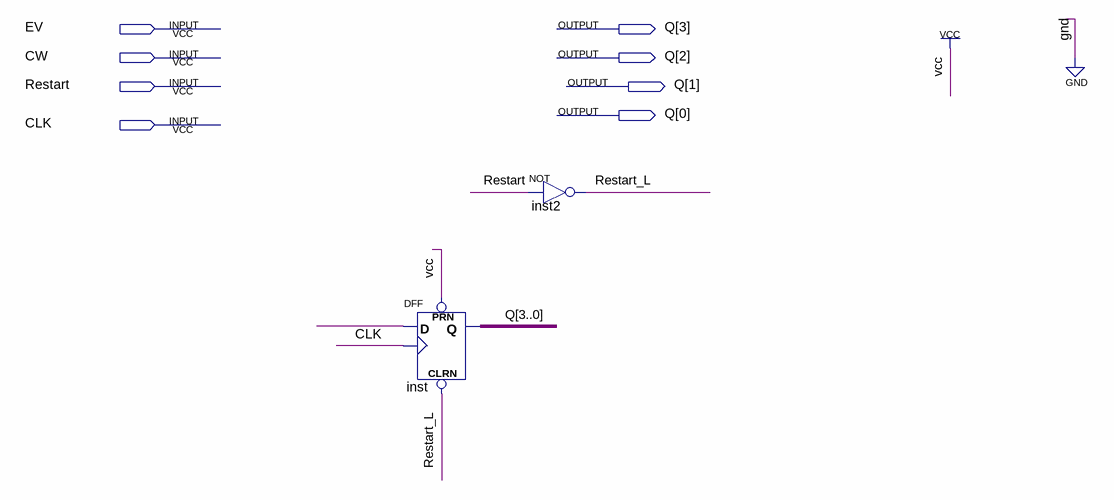
[diagram p0: schematic sheet]
// Quartus schematic Lab5_DFF_Traf_Cont.bdf as structural Verilog: 2 symbols, 8 pins
module Lab5_DFF_Traf_Cont (
  input  EV,
  input  CW,
  input  Restart,
  input  CLK,
  output [3:0] Q
);

  wire Restart_L, undriven;

  DFF inst[3:0] (.CLRN(Restart_L), .CLK(CLK), .D(undriven), .PRN(1'b1), .Q(Q));
  not inst2 (Restart_L, Restart);
endmodule
